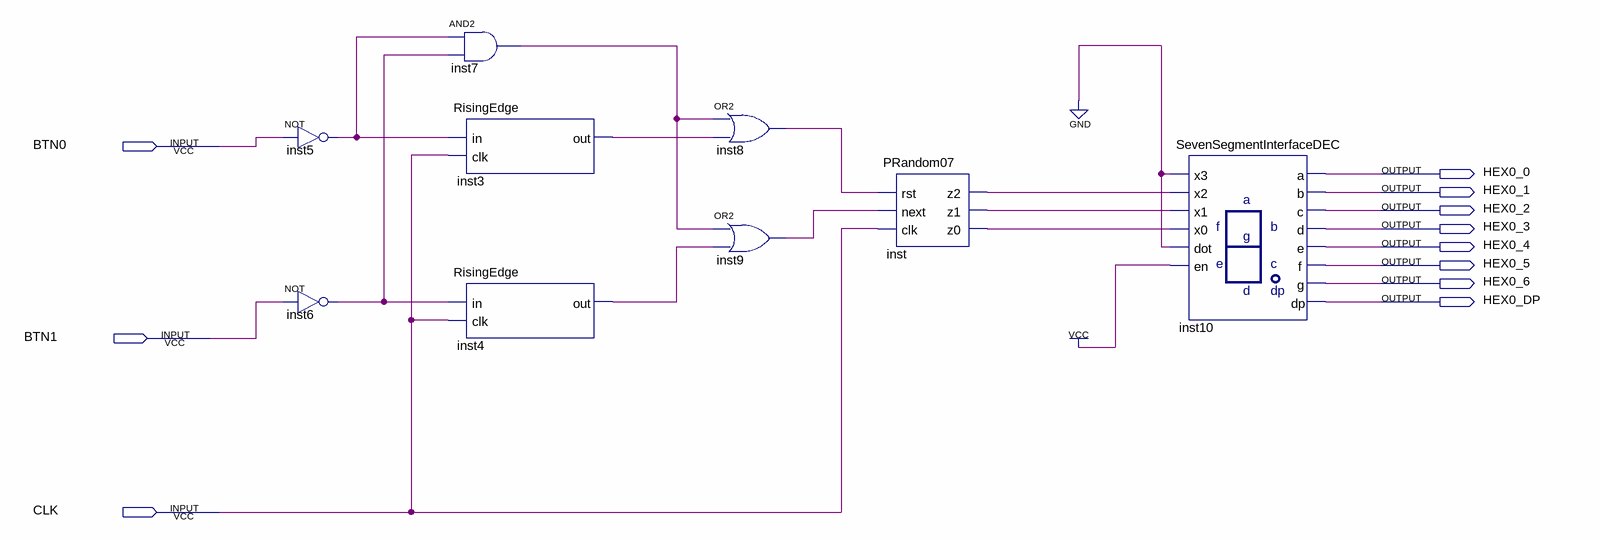
[diagram p0: schematic sheet]
// Quartus schematic DOMACI2.bdf as structural Verilog: 9 symbols, 11 pins
module DOMACI2 (
  input  BTN0,
  input  BTN1,
  input  CLK,
  output HEX0_0,
  output HEX0_1,
  output HEX0_2,
  output HEX0_3,
  output HEX0_4,
  output HEX0_5,
  output HEX0_6,
  output HEX0_DP
);

  wire inst3_output, inst4_output, inst5_out, inst6_out, inst7_out, inst8_out, inst9_out, inst_z0, inst_z1,
       inst_z2;

  not inst5 (inst5_out, BTN0);
  not inst6 (inst6_out, BTN1);
  and inst7 (inst7_out, inst5_out, inst6_out);
  RisingEdge inst3 (.clk(CLK), .\input (inst5_out), .\output (inst3_output));
  RisingEdge inst4 (.clk(CLK), .\input (inst6_out), .\output (inst4_output));
  or inst8 (inst8_out, inst7_out, inst3_output);
  or inst9 (inst9_out, inst7_out, inst4_output);
  PRandom07 inst (.rst(inst8_out), .next(inst9_out), .clk(CLK), .z2(inst_z2), .z1(inst_z1), .z0(inst_z0));
  SevenSegmentInterfaceDEC inst10 (
    .x3(1'b0), .x2(inst_z2), .x1(inst_z1), .x0(inst_z0), .dot(1'b0), .en(1'b1), .a(HEX0_0), .b(HEX0_1),
    .c(HEX0_2), .d(HEX0_3), .e(HEX0_4), .f(HEX0_5), .g(HEX0_6), .dp(HEX0_DP));
endmodule
